# Altium schematic sheet analog_tlv379_buffer.SchDoc
size A
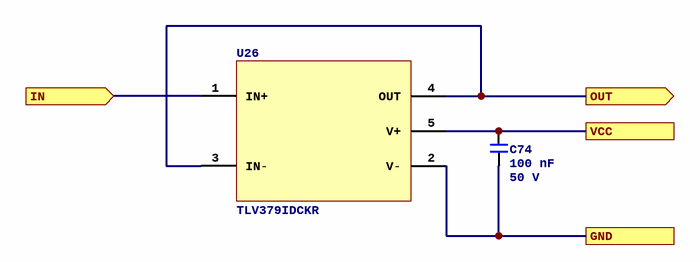
[diagram p0: analog_tlv379_buffer.SchDoc]

## Parts
C74  Capacitance: 100 nF  Voltage Rating: 50 V  [C0402]  (hidden comment: CL05B104KB54PNC)
U26  TLV379IDCKR  [5SC70]

## Ports
GND, IN (in), OUT (out), VCC

## Nets
GND: C74.2 U26.2(V-) ; port GND
IN: U26.1(IN+) ; port IN
OUT: U26.3(IN-) U26.4(OUT) ; port OUT
VCC: C74.1 U26.5(V+) ; port VCC

## Library data of the parts
C74 = CL05B104KB54PNC: Manufacturer: Samsung Electro-Mechanics; Dielectric: X7R; ComponentLink1URL: https://wmsc.lcsc.com/wmsc/upload/file/pdf/v2/lcsc/2304140030_Samsung-Electro-Mechanics-CL05B104KB54PNC_C307331.pdf; ComponentLink1Description: Datasheet; Manufacturer Part Number: CL05B104KB54PNC; Package: 0402; Supplier 2: LCSC; Supplier Part Number 2: C307331
U26 = TLV379IDCKR: Low-Voltage, 4-µA, Rail-to-Rail I/O Operational Amplifier for Cost-Sensitive Systems 5-SC70 -40 to 125; Manufacturer: Texas Instruments; Supplier 1: DigiKey; Supplier Part Number 1: 296-47844-1-ND; Manufacturer Part Number: TLV379IDCKR; Supplier Part Number 2: C2860386; ComponentLink1Description: Datasheet; ComponentLink1URL: https://www.ti.com/lit/ds/symlink/tlv379.pdf; Supplier 2: LCSC; Supplier 3: Mouser; Supplier Part Number 3: 595-TLV379IDCKR